# EAGLE design myPCB2 (EAGLE 9.6.2)
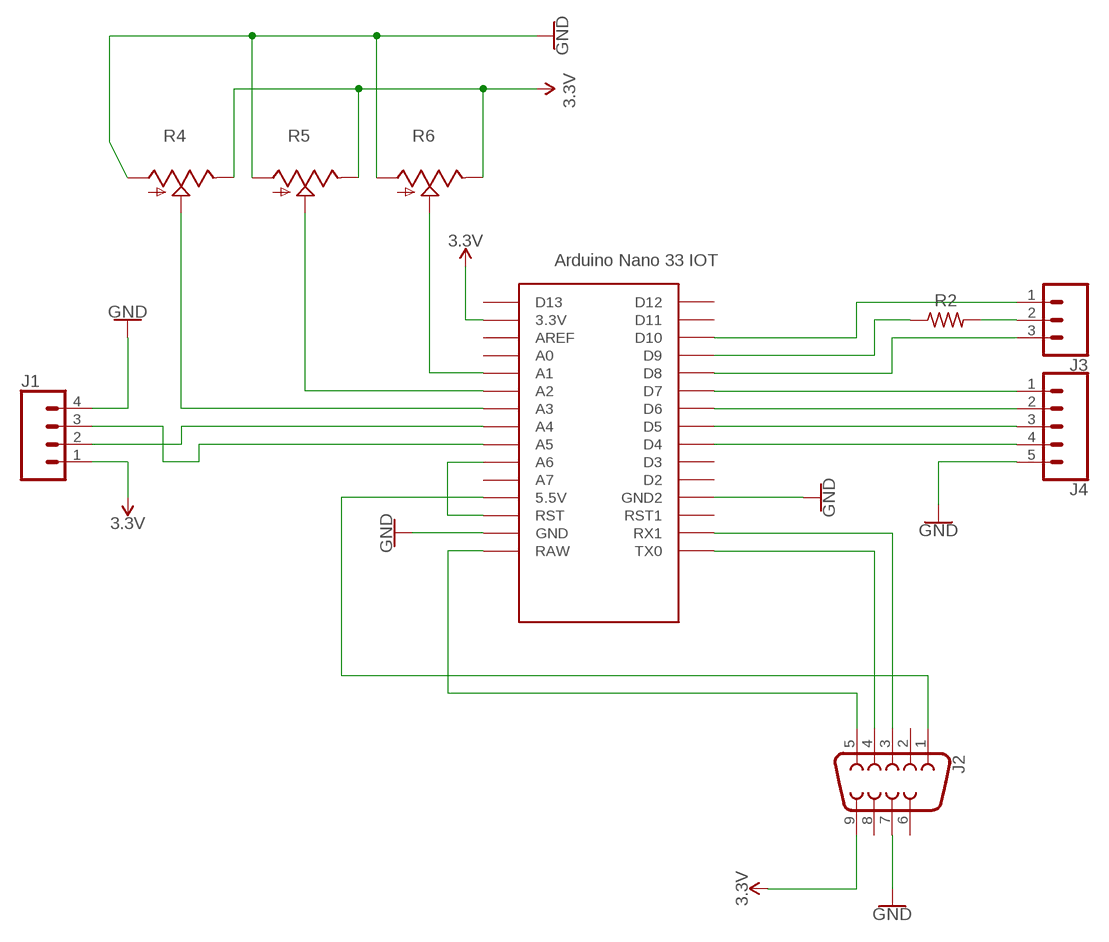
[diagram p0: schematic, sheet 1]

## Parts
J1  CONN_04  [1X04]
J2  DB9FEMALE  [DB9]
J3  CONN_03  [1X03]
J4  CONN_05  [1X05]
R2  R-US_AXIAL-7.2MM-PITCH  [RESAD724W46L381D178B]
R4  TRIM_US-S63P  [S63P]
R5  TRIM_US-S63P  [S63P]
R6  TRIM_US-S63P  [S63P]
U$2  NANO33IOT  [NANO33IOT]

## Nets
3.3V [3.3V]: J1.1 J2.9 R4.E R5.E R6.E U$2.3.3V
GND [GND]: J1.4 J2.7 J4.5 R4.A R5.A R6.A U$2.GND U$2.GND1(GND2)
N$1: J2.3 U$2.RX1
N$2: J3.3 U$2.D8
N$3: J4.3 U$2.D5
N$4: J4.4 U$2.D4
N$5: J1.2 U$2.A4
N$6: J2.4 U$2.TX0
N$7: J1.3 U$2.A5
N$8: J2.5 U$2.RAW
N$9 [5.0V]: J2.1 U$2.5V(5.5V)
N$10: R2.1 U$2.D9
N$11: U$2.A6 U$2.RST
N$12: J4.1 U$2.D7
N$13: J3.1 U$2.D10
N$14: R6.S U$2.A1
N$15: R5.S U$2.A2
N$16: R4.S U$2.A3
N$17: J4.2 U$2.D6
N$18: J3.2 R2.2
Unconnected: J2.2 J2.6 J2.8 U$2.A0 U$2.A7 U$2.AREF U$2.D2 U$2.D3 U$2.D11 U$2.D12 U$2.D13 U$2.RST1

## Library data of the parts
J1 = SparkFun-Connectors:CONN_04: Multi connection point. Often used as Generic Header-pin footprint for 0.1 inch spaced/style header connections On any of the 0.1 inch spaced packages, you can populate with these: Break Away Headers - Straight <https://www.sparkfun.com/products/116> (PRT-00116) Break Away Male Headers - Right Angle <https://www.sparkfun.com/products/553> (PRT-00553) Female Headers <https://www.sparkfun.com/products/115> (PRT-00115) Break Away Headers - Machine Pin <https://www.sparkfun.com/products/117> (PRT-00117) Break Away Female Headers - Swiss Machine Pin <https://www.sparkfun.com/products/743> (PRT-00743) For SCREWTERMINALS and SPRING TERMINALS visit here: Screw Terimnals on SparkFun.com <https://www.sparkfun.com/search/results?term=Screw+Terminals> (5mm/3.5mm/2.54mm spacing) This device is also useful as a general connection point to wire up your design to another part of your project. Our various solder wires solder well into these plated through hole pads. Hook-Up Wire - Assortment (Stranded, 22 AWG) <https://www.sparkfun.com/products/11375> (PRT-11375) Hook-Up Wire - Assortment (Solid Core, 22 AWG) <https://www.sparkfun.com/products/11367> (PRT-11367) View the entire wire category on our website here <https://www.sparkfun.com/categories/141> Special notes: Molex polarized connector foot print use with SKU : PRT-08231 with associated crimp pins and housings. 1MM SMD Version SKU: PRT-10208; PROD_ID: CONN-09696
J2 = SparkFun-Connectors:DB9: DB9 Connector Standard DB9 (D-Sub 9) serial connector. Can be used for CAN bus as well as RS485 and RS232. Footprint production proven. Here is the female version connector we sell at SparkFun: 9 Pin Female Serial Connector - PCB Mount <https://www.sparkfun.com/products/429> (PRT-00429) This connector has been used on the following SparkFun products: SparkFun RS232 Shifter - SMD <https://www.sparkfun.com/products/449> (PRT-00449) SparkFun RS232 Shifter SMD (No DB9) <https://www.sparkfun.com/products/8780> (PRT-08780); PROD_ID: CONN-08194
J3 = SparkFun-Connectors:CONN_03: Multi connection point. Often used as Generic Header-pin footprint for 0.1 inch spaced/style header connections On any of the 0.1 inch spaced packages, you can populate with these: Break Away Headers - Straight <https://www.sparkfun.com/products/116> (PRT-00116) Break Away Male Headers - Right Angle <https://www.sparkfun.com/products/553> (PRT-00553) Female Headers <https://www.sparkfun.com/products/115> (PRT-00115) Break Away Headers - Machine Pin <https://www.sparkfun.com/products/117> (PRT-00117) Break Away Female Headers - Swiss Machine Pin <https://www.sparkfun.com/products/743> (PRT-00743) Stackable Header - 3 Pin (Female, 0.1") <https://www.sparkfun.com/products/13875> (PRT-13875) For SCREWTERMINALS and SPRING TERMINALS visit here: Screw Terimnals on SparkFun.com <https://www.sparkfun.com/search/results?term=Screw+Terminals> (5mm/3.5mm/2.54mm spacing) This device is also useful as a general connection point to wire up your design to another part of your project. Our various solder wires solder well into these plated through hole pads. Hook-Up Wire - Assortment (Stranded, 22 AWG) <https://www.sparkfun.com/products/11375> (PRT-11375) Hook-Up Wire - Assortment (Solid Core, 22 AWG) <https://www.sparkfun.com/products/11367> (PRT-11367) View the entire wire category on our website here <https://www.sparkfun.com/categories/141> Special notes: Molex polarized connector foot print use with SKU : PRT-08232 with associated crimp pins and housings.
J4 = SparkFun-Connectors:CONN_05: Multi connection point. Often used as Generic Header-pin footprint for 0.1 inch spaced/style header connections On any of the 0.1 inch spaced packages, you can populate with these: Break Away Headers - Straight <https://www.sparkfun.com/products/116> (PRT-00116) Break Away Male Headers - Right Angle <https://www.sparkfun.com/products/553> (PRT-00553) Female Headers <https://www.sparkfun.com/products/115> (PRT-00115) Break Away Headers - Machine Pin <https://www.sparkfun.com/products/117> (PRT-00117) Break Away Female Headers - Swiss Machine Pin <https://www.sparkfun.com/products/743> (PRT-00743) For SCREWTERMINALS and SPRING TERMINALS visit here: Screw Terimnals on SparkFun.com <https://www.sparkfun.com/search/results?term=Screw+Terminals> (5mm/3.5mm/2.54mm spacing) This device is also useful as a general connection point to wire up your design to another part of your project. Our various solder wires solder well into these plated through hole pads. Hook-Up Wire - Assortment (Stranded, 22 AWG) <https://www.sparkfun.com/products/11375> (PRT-11375) Hook-Up Wire - Assortment (Solid Core, 22 AWG) <https://www.sparkfun.com/products/11367> (PRT-11367) View the entire wire category on our website here <https://www.sparkfun.com/categories/141> Special notes: Molex polarized connector foot print use with SKU : PRT-08231 with associated crimp pins and housings. 1MM SMD Version SKU: PRT-10208
R2 = Resistor:R-US: Resistor Fixed - ANSI; CATEGORY: Resistor; SUB-CATEGORY: Fixed
R4-R6 = pot:TRIM_US-: POTENTIOMETER
U$2 = Arduino-clone:NANO33IOT

## Net classes
0 default: width 1.016 mm, clearance 0.127 mm
1 GND: width 1.016 mm, clearance 0.127 mm
2 5.0V: width 1.524 mm, clearance 0.635 mm
3 3.3V: width 1.016 mm, clearance 0.127 mm
4 VIN: width 1.524 mm, clearance 0.635 mm

## Board
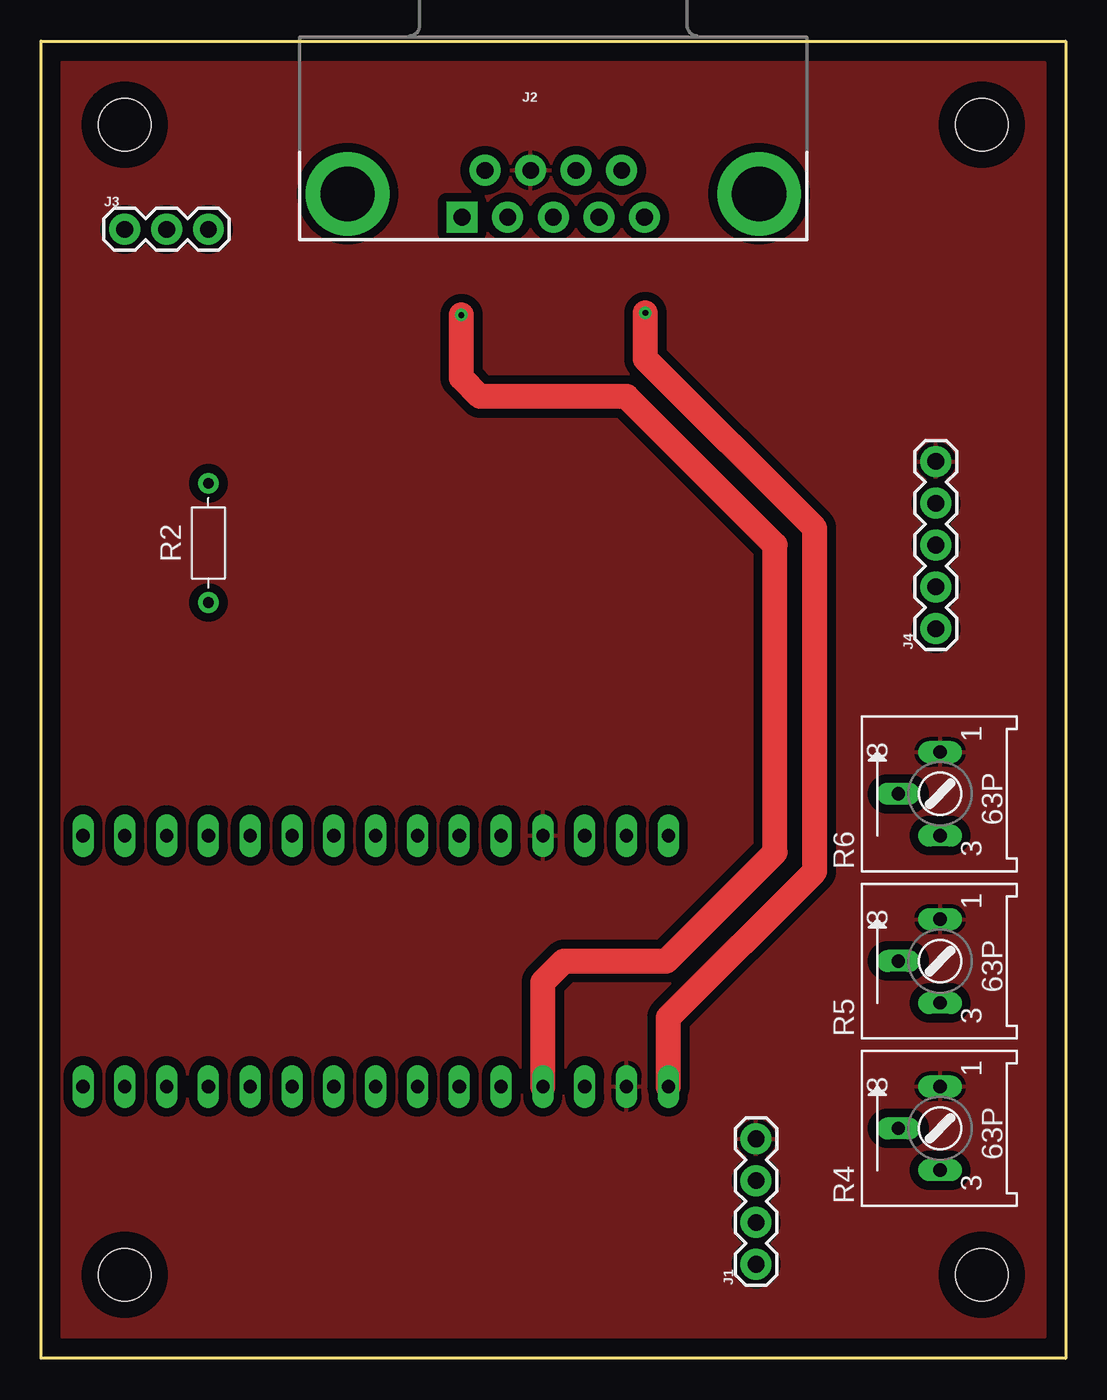
[diagram p1: board, top side]
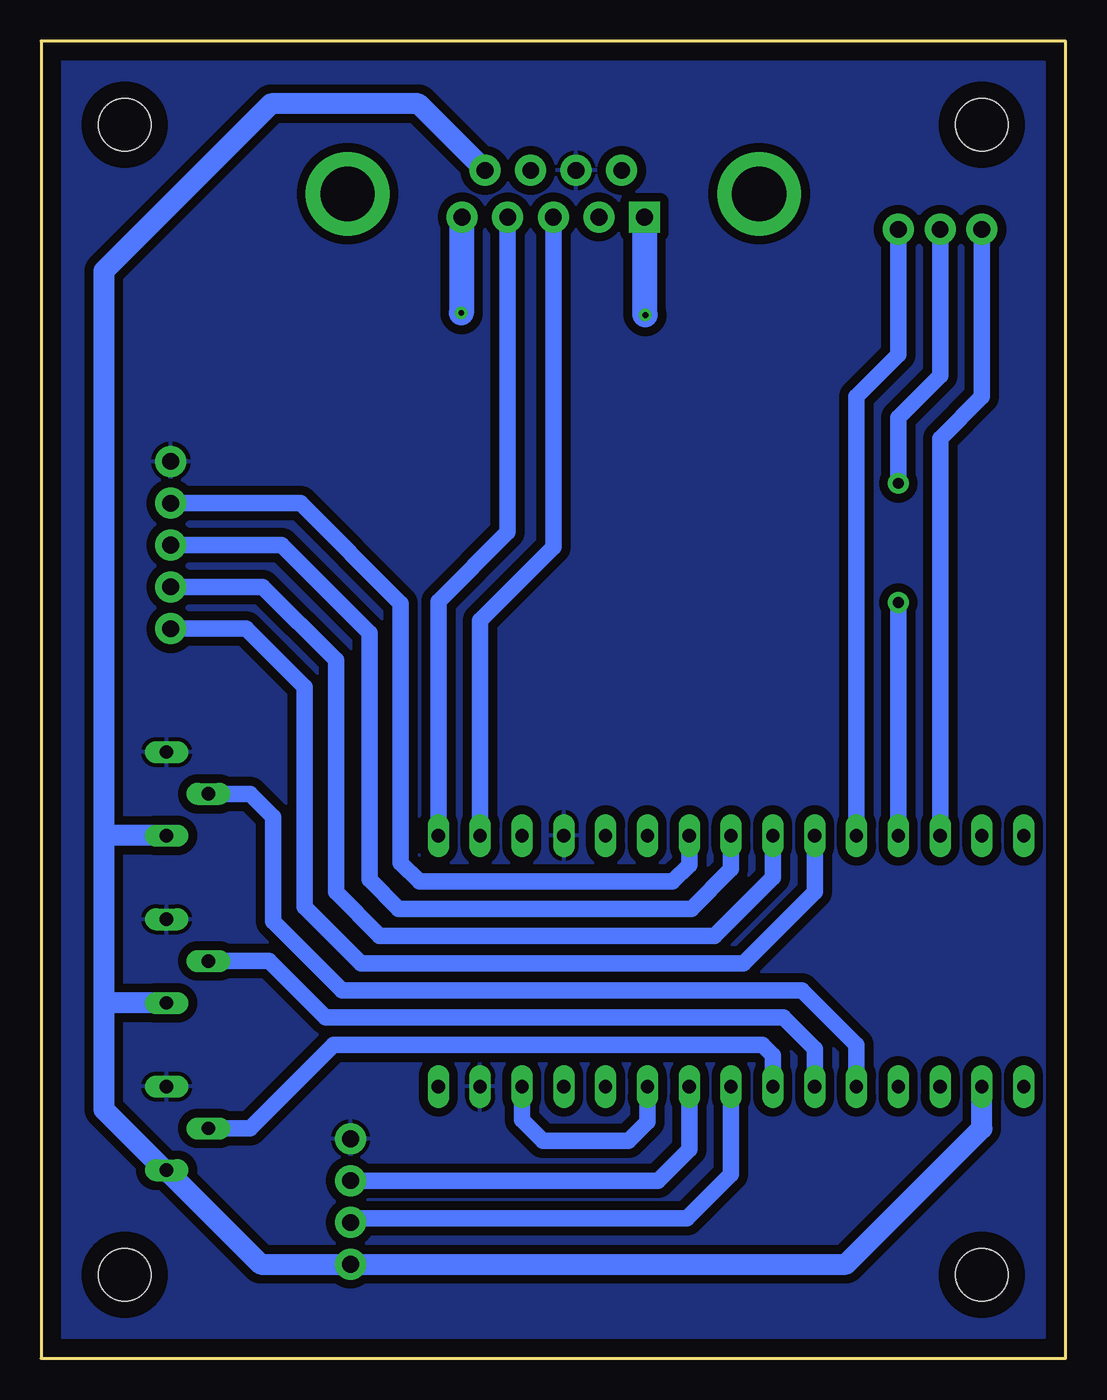
[diagram p2: board, bottom side, seen from below]

Size 62.23 x 80.01 mm. Coordinates in mm from the lower left corner, seen from the top.
Outline: 0,80.01 62.23,80.01 62.23,0 0,0 0,80.01
Copper layers (1*16): Top 0.035mm / dielectric 1.5mm / Bottom 0.035mm
Design rules "default": minimum track width 6mil, minimum drill 0.35mm, track to track 6mil, track to pad 6mil, pad to pad 6mil, via to via 6mil, smd to smd 6mil, copper to edge 40mil, drill to drill 6mil, minimum pad ring 10mil, minimum via ring 8mil, stop-mask expansion 4mil, vias tented up to drill 0mil, thermal gap 10mil
Holes 3.17 mm at 5.08,74.93 57.15,74.93 5.08,5.08 57.15,5.08

### Footprints (pad centres in the part's own frame; a part is rotated, then mirrored left to right if it is on the bottom)
1X04 = drill 1.016 pad 1.88: 1 0,0; 2 2.54,0; 3 5.08,0; 4 7.62,0
DB9 = drill 1.016 pad 1.88 square: 1 -5.54,-1.42 | drill 1.016 pad 1.88: 2 -2.77,-1.42; 3 0,-1.42; 4 2.77,-1.42; 5 5.54,-1.42; 6 -4.15,1.42; 7 -1.38,1.42; 8 1.38,1.42; 9 4.15,1.42 | drill 3.302 pad 5.08: G1 -12.5,0; G2 12.5,0
1X03 = drill 1.016 pad 1.88: 1 0,0; 2 2.54,0; 3 5.08,0
1X05 = drill 1.016 pad 1.88: 1 0,0; 2 2.54,0; 3 5.08,0; 4 7.62,0; 5 10.16,0
RESAD724W46L381D178B = drill 0.66 pad 1.26: 1 -3.62,0; 2 3.62,0
S63P = drill 0.813 long: A 2.54,0; E -2.54,0; S 0,2.54
NANO33IOT = drill 0.8 long: 3.3V -10.16,24.13; 5V -10.16,-1.27; A0 -10.16,19.05; A1 -10.16,16.51; A2 -10.16,13.97; A3 -10.16,11.43; A4 -10.16,8.89; A5 -10.16,6.35; A6 -10.16,3.81; A7 -10.16,1.27; AREF -10.16,21.59; D2 5.08,1.27; D3 5.08,3.81; D4 5.08,6.35; D5 5.08,8.89; D6 5.08,11.43; D7 5.08,13.97; D8 5.08,16.51; D9 5.08,19.05; D10 5.08,21.59; D11 5.08,24.13; D12 5.08,26.67; D13 -10.16,26.67; GND -10.16,-6.35; GND1 5.08,-1.27; RAW -10.16,-8.89; RST -10.16,-3.81; RST1 5.08,-3.81; RX1 5.08,-6.35; TX0 5.08,-8.89

### Placement (x,y rotation side)
J1  43.43,5.72 90 top
J2  31.12,70.74 0 top
J3  5.08,68.58 0 top
J4  54.36,44.32 90 top
R2  10.16,49.53 90 top
R4  54.61,13.97 90 top
R5  54.61,24.13 90 top
R6  54.61,34.29 90 top
U$2  29.21,26.67 90 top

### Tracks (layer width: path | path; a pad name or v marks a point on that pad's centre or on a via)
3.3V
  Bottom 1.27: J2.9 39.31,76.2 48.26,76.2 58.42,66.04 58.42,31.75 | 58.42,31.75 58.42,21.59 | 58.42,21.59 58.42,15.11 54.74,11.43 R4.E 48.9,5.72 J1.1 13.34,5.72 5.08,13.97 U$2.3.3V | R6.E 58.42,31.75 | R5.E 58.42,21.59
GND
  pour Bottom (isolate 0.533, rank 6): 60.96,1.27 1.27,1.27 1.27,78.74 60.96,78.74
  pour Top (isolate 0.533, rank 6): 1.27,78.74 60.96,78.74 60.96,1.27 1.27,1.27
N$1
  Bottom 1.016: J2.3 31.12,49.28 35.56,44.83 U$2.RX1
N$2
  Bottom 1.016: U$2.D8 12.7,58.42 10.16,60.96 J3.3
N$3
  Bottom 1.016: U$2.D5 20.32,29.72 22.73,27.3 40.51,27.3 42.29,29.08 42.29,44.07 47.62,49.4 J4.3
N$4
  Bottom 1.016: J4.4 46.48,51.94 40.39,45.85 40.39,30.1 39.24,28.96 23.88,28.96 22.86,29.97 U$2.D4
N$5
  Bottom 1.016: J1.2 43.18,8.51 22.99,8.51 20.32,11.18 U$2.A4
N$6
  Bottom 1.016: J2.4 33.88,50.19 38.1,45.97 U$2.TX0
N$7
  Bottom 1.016: J1.3 24.77,10.8 22.86,12.7 U$2.A5
N$8  (via drill 0.35)
  Top 1.524: U$2.RAW 38.1,20.7 46.99,29.59 46.99,50.42 36.7,60.71 v36.7,63.5
  Bottom 1.524: J2.5 36.7,69.27 v36.7,63.5
N$9  (via drill 0.35)
  Top 1.524: U$2.5V 30.48,22.86 31.75,24.13 37.97,24.13 44.58,30.73 44.58,49.4 35.56,58.42 26.67,58.42 25.53,59.56 v25.53,63.37
  Bottom 1.524: J2.1 25.57,63.42 v25.53,63.37
N$10
  Bottom 1.016: U$2.D9 R2.1
N$11
  Bottom 1.016: U$2.A6 25.4,14.35 26.54,13.21 31.75,13.21 33.02,14.48 U$2.RST
N$12
  Bottom 1.016: J4.1 49.78,44.32 46.23,40.77 46.23,27.43 42.8,24 19.56,24 15.24,28.32 U$2.D7
N$13
  Bottom 1.016: U$2.D10 7.62,55.88 5.08,58.42 J3.1
N$14
  Bottom 1.016: R6.S 49.53,34.29 48.13,32.89 48.13,26.54 43.94,22.35 16,22.35 12.7,19.05 U$2.A1
N$15
  Bottom 1.016: R5.S 48.39,24.13 44.96,20.7 17.14,20.7 15.24,18.8 U$2.A2
N$16
  Bottom 1.016: R4.S 49.53,13.97 44.45,19.05 18.41,19.05 17.78,18.41 U$2.A3
N$17
  Bottom 1.016: J4.2 48.77,46.86 44.32,42.42 44.32,28.32 41.66,25.65 21.34,25.65 17.78,29.21 U$2.D6
N$18
  Bottom 1.016: R2.2 10.16,57.15 7.62,59.69 J3.2